# EAGLE board zenith (EAGLE 9.6.2), part 1 of 2
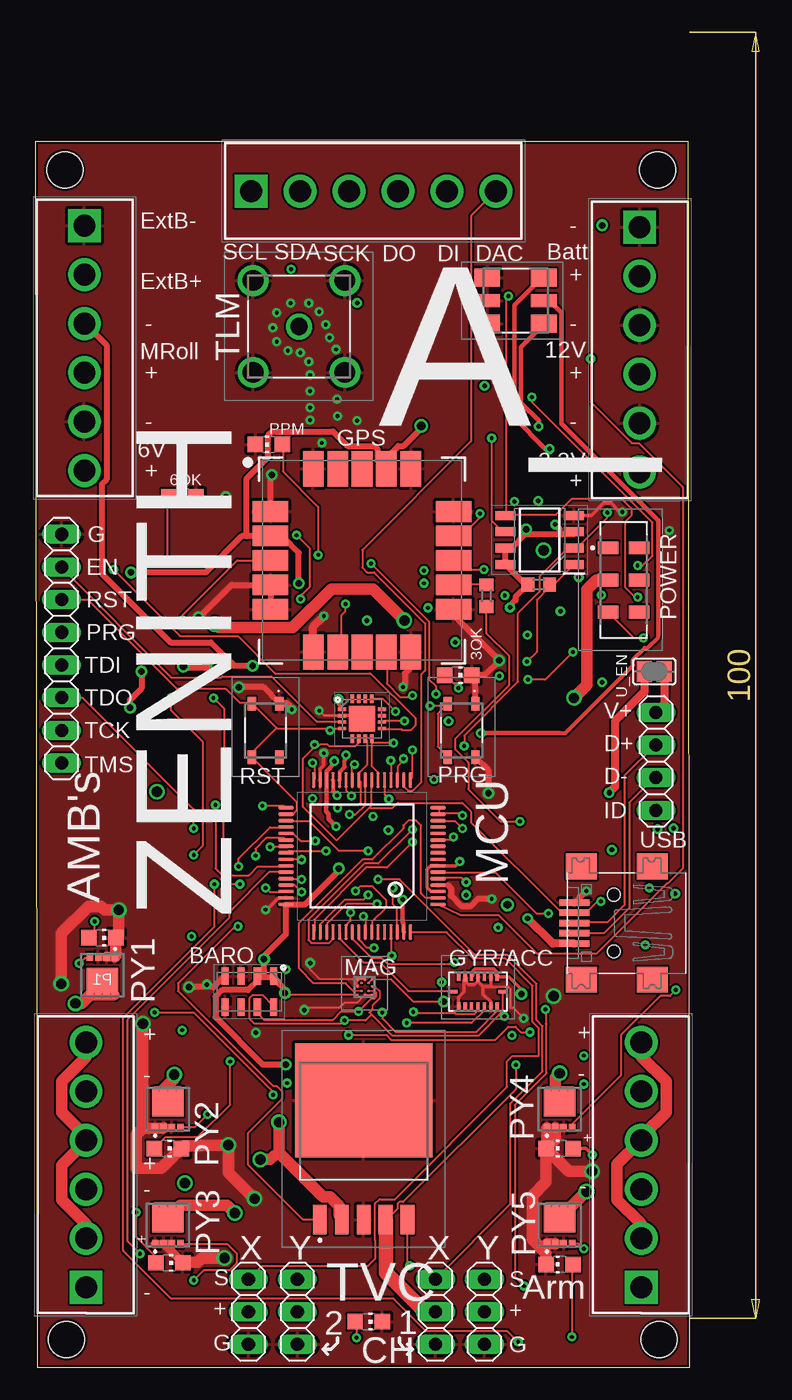
[diagram p5: board, top side]
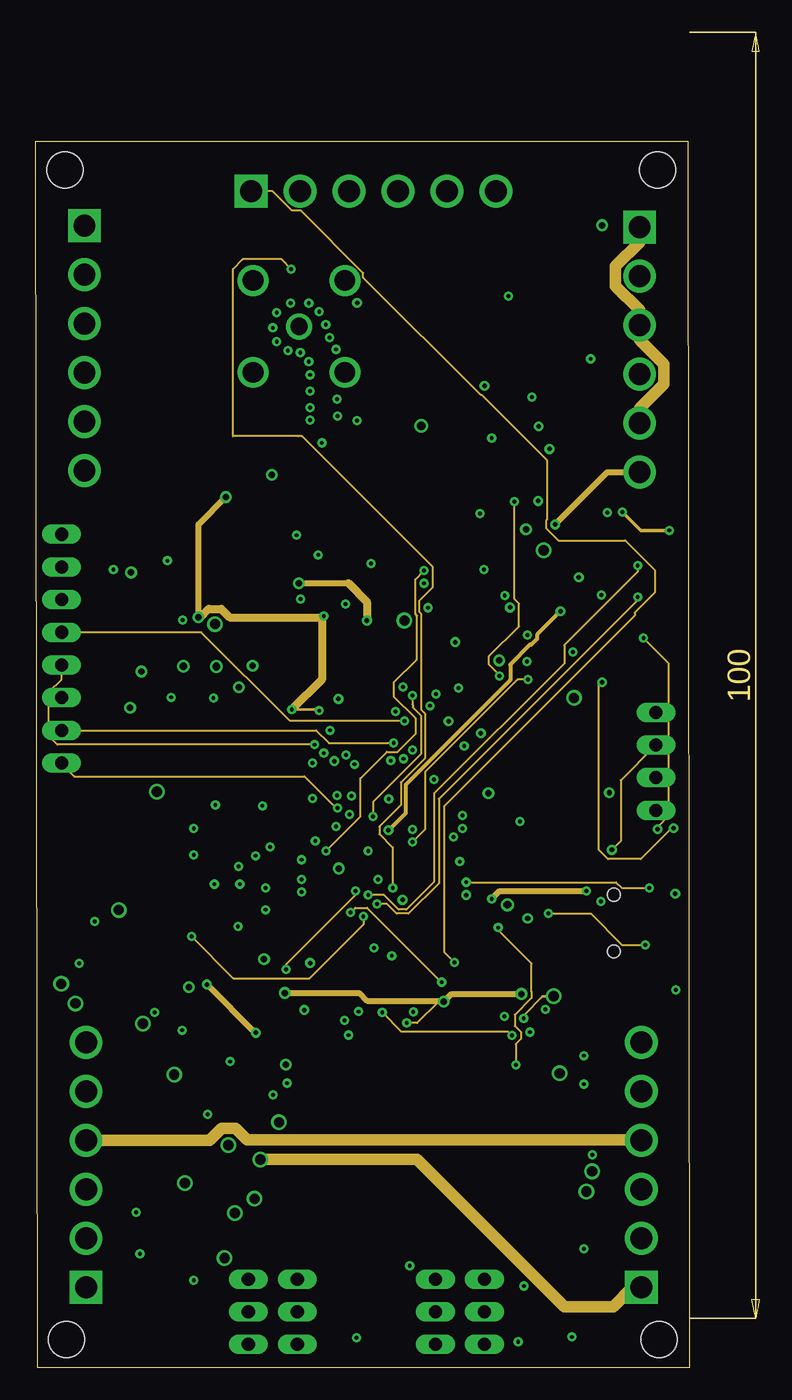
[diagram p6: board, inner layer Route2]
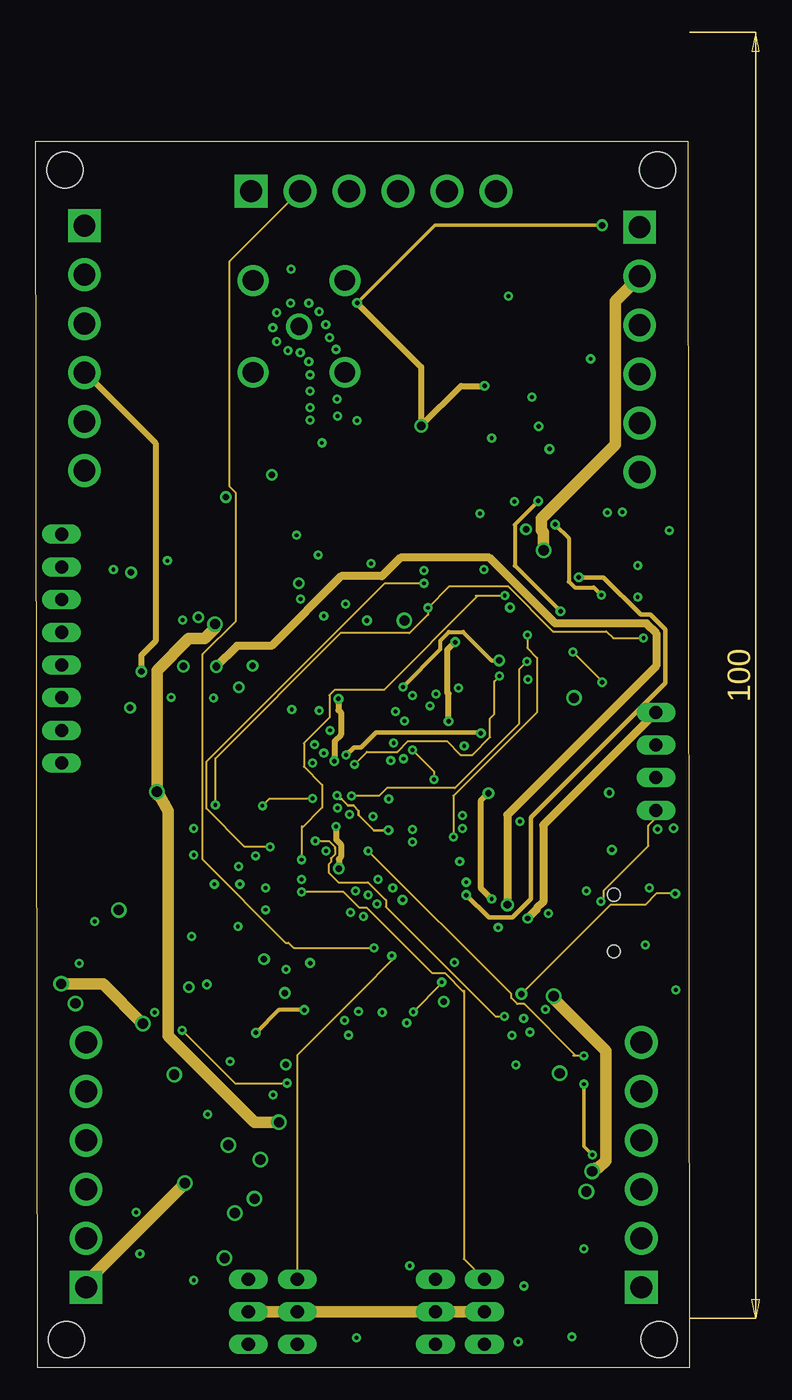
[diagram p7: board, inner layer Route15]
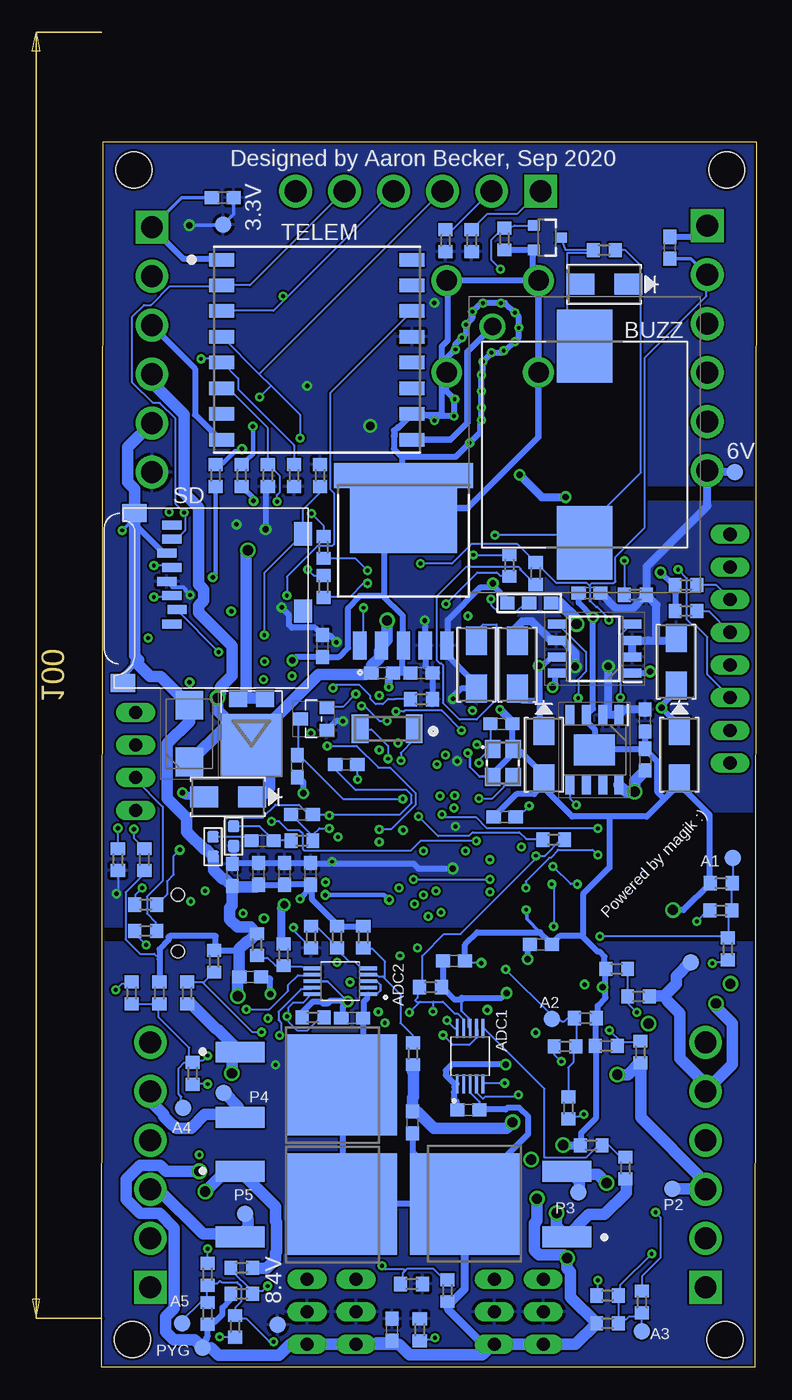
[diagram p8: board, bottom side, seen from below]

Size 50.91 x 95.3 mm. Coordinates in mm from the lower left corner, seen from the top.
Outline: 0.13,0 50.91,0 50.78,95.3 0,95.3 0.13,0
Copper layers (1+2*15+16): Top 0.035mm / dielectric 0.2mm / Route2 0.0175mm / dielectric 1.065mm / Route15 0.0175mm / dielectric 0.2mm / Bottom 0.035mm
Design rules "default *": minimum track width 5mil, minimum drill 0.3mm, track to track 6mil, track to pad 6mil, pad to pad 5mil, via to via 10mil, smd to smd 5mil, copper to edge 0.2mm, drill to drill 10mil, minimum pad ring 10mil, minimum via ring 8mil, stop-mask expansion 4mil, vias tented up to drill 0mil, thermal gap 10mil
Net classes: 0 default: width 0.127 mm
Holes 2.8 mm at 2.41,2.16 48.51,2.16 2.29,93.09 48.39,93.09

## Footprints (pad centres in the part's own frame; a part is rotated, then mirrored left to right if it is on the bottom)
B1,27 = smd 1.27 x 1.27: TP 0,0
CHIP-LED0805 = smd 1.2 x 1.2: A 0,-1.05; C 0,1.05
MICROSD = smd 0.7 x 1.5: 1 9,-10.64; 2 7.9,-10.24; 3 6.8,-10.64; 4 5.7,-11.04; 5 4.6,-10.64; 6 3.5,-11.04; 7 2.4,-10.64; 8 1.3,-10.64 | smd 1.8 x 1.4: CD1 2,-0.44; CD2 8,-0.44 | smd 1.4 x 1.9: MT1 0.4,-13.54; MT2 13.6,-14.44
SOT-23 = smd 1.016 x 1.143: 1 -0.889,-1.016; 2 0.889,-1.016; 3 0,1.016
L0603 = smd 0.889 x 0.889: 1 -0.762,0; 2 0.762,0
C0603 = smd 1.1 x 1: 1 -0.85,0; 2 0.85,0
USB-MINIB = smd 0.5 x 2.308: D+ 0,4.064; D- -0.8,4.064; GND 1.6,4.064; ID 0.8,4.064; VBUS -1.6,4.064 | smd 2 x 2.4: GND1 -4.4,-2; GND2 -4.4,3.5; GND3 4.4,3.5; GND4 4.4,-2 | hole 1: -2.2,1; 2.2,1
SMA_DIO = smd 2.18 x 1.63: 1 -1.857,0; 2 1.857,0
SMA_NO_LABELS = smd 2.18 x 1.63: 1 -1.857,0; 2 1.857,0
TO-277A(SMPC) = smd 1.4 x 1.3: A1 -1.04,-2.725; A2 1.04,-2.725 | smd 4.72 x 4.8: K 0,0.875
EPSON-FA-238 = smd 1.4 x 1.2: 1 -1.1,-0.8; 2 1.1,-0.8; 3 1.1,0.8; 4 -1.1,0.8
SOIC127P600X100-9N = smd 1.525 x 0.7: 1 -2.712,1.905; 2 -2.712,0.635; 3 -2.712,-0.635; 4 -2.712,-1.905; 5 2.712,-1.905; 6 2.712,-0.635; 7 2.712,0.635; 8 2.712,1.905 | smd 2.4 x 3.2: 9 0,0
BMI088 = smd 0.25 x 0.675: 1 -1.5,1.165; 2 -1,1.165; 3 -0.5,1.165; 4 0,1.165; 5 0.5,1.165; 6 1,1.165; 7 1.5,1.165; 9 1.5,-1.165; 10 1,-1.165; 11 0.5,-1.165; 12 0,-1.165; 13 -0.5,-1.165; 14 -1,-1.165; 15 -1.5,-1.165 | smd 0.675 x 0.25: 8 1.915,0; 16 -1.915,0
BMM150 = smd 0.2 x 0.2: A1 0.566,0.601; A3 0.566,0.035; A5 0.566,-0.601; B2 0.283,0.318; B4 0.283,-0.283; C1 0,0.601; C5 0,-0.601; D2 -0.283,0.318; D4 -0.283,-0.283; E1 -0.566,0.601; E3 -0.566,0.035; E5 -0.566,-0.601
SOIC127P620X171-8N = smd 1.35 x 0.7: 1 -2.95,1.905; 2 -2.95,0.635; 3 -2.95,-0.635; 4 -2.95,-1.905; 5 2.95,-1.905; 6 2.95,-0.635; 7 2.95,0.635; 8 2.95,1.905
QFN50P300X300X65-17N = smd 0.65 x 0.25: 1 -1.55,0.75; 2 -1.55,0.25; 3 -1.55,-0.25; 4 -1.55,-0.75; 9 1.55,-0.75; 10 1.55,-0.25; 11 1.55,0.25; 12 1.55,0.75 | smd 0.25 x 0.65: 5 -0.75,-1.55; 6 -0.25,-1.55; 7 0.25,-1.55; 8 0.75,-1.55; 13 0.75,1.55; 14 0.25,1.55; 15 -0.25,1.55; 16 -0.75,1.55 | smd 2 x 2: 17 0,0
KTT0005B = smd 2.16 x 1.02: 1 12.461,-3.4; 2 12.461,-1.7; 3 12.461,0; 4 12.461,1.7; 5 12.461,3.4 | smd 6.99 x 8.33: 6 1.786,0 | smd 1.91 x 1.235: 7 -0.754,4.782; 8 -0.754,-4.782
SON125P300X500X100-8N = smd 1.35 x 0.55: 1 -1.2,1.875; 2 -1.2,0.625; 3 -1.2,-0.625; 4 -1.2,-1.875; 5 1.2,-1.875; 6 1.2,-0.625; 7 1.2,0.625; 8 1.2,1.875
SOIC127P600X175-8N = smd 1.55 x 0.7: 1 -2.675,1.905; 2 -2.675,0.635; 3 -2.675,-0.635; 4 -2.675,-1.905; 5 2.675,-1.905; 6 2.675,-0.635; 7 2.675,0.635; 8 2.675,1.905
SHDR6W105P0X381_1X6_2285X730X8 = drill 1.7 pad 2.55 square: 1 0,0 | drill 1.7 pad 2.55: 2 3.81,0; 3 7.62,0; 4 11.43,0; 5 15.24,0; 6 19.05,0
1420701211 = drill 1.346 pad 2.019: 1 0,0 | drill 1.6 pad 2.4: 2 -3.569,3.569; 3 -3.569,-3.569; 4 3.569,-3.569; 5 3.569,3.569
1X08 = drill 1.016 long: 1 -8.89,0; 2 -6.35,0; 3 -3.81,0; 4 -1.27,0; 5 1.27,0; 6 3.81,0; 7 6.35,0; 8 8.89,0
1X04 = drill 1.016 long: 1 -3.81,0; 2 -1.27,0; 3 1.27,0; 4 3.81,0
1X03 = drill 1.016 long: 1 -2.54,0; 2 0,0; 3 2.54,0
LQFP64-05 = smd 1.2 x 0.25: 1 -5.915,3.759; 2 -5.915,3.251; 3 -5.915,2.743; 4 -5.915,2.261; 5 -5.915,1.753; 6 -5.915,1.245; 7 -5.915,0.762; 8 -5.915,0.254; 9 -5.915,-0.254; 10 -5.915,-0.762; 11 -5.915,-1.245; 12 -5.915,-1.753; 13 -5.915,-2.261; 14 -5.915,-2.743; 15 -5.915,-3.251; 16 -5.915,-3.759; 33 5.915,-3.759; 34 5.915,-3.251; 35 5.915,-2.743; 36 5.915,-2.261; 37 5.915,-1.753; 38 5.915,-1.245; 39 5.915,-0.762; 40 5.915,-0.254; 41 5.915,0.254; 42 5.915,0.762; 43 5.915,1.245; 44 5.915,1.753; 45 5.915,2.261; 46 5.915,2.743; 47 5.915,3.251; 48 5.915,3.759 | smd 0.25 x 1.2: 17 -3.759,-5.915; 18 -3.251,-5.915; 19 -2.743,-5.915; 20 -2.261,-5.915; 21 -1.753,-5.915; 22 -1.245,-5.915; 23 -0.762,-5.915; 24 -0.254,-5.915; 25 0.254,-5.915; 26 0.762,-5.915; 27 1.245,-5.915; 28 1.753,-5.915; 29 2.261,-5.915; 30 2.743,-5.915; 31 3.251,-5.915; 32 3.759,-5.915; 49 3.759,5.915; 50 3.251,5.915; 51 2.743,5.915; 52 2.261,5.915; 53 1.753,5.915; 54 1.245,5.915; 55 0.762,5.915; 56 0.254,5.915; 57 -0.254,5.915; 58 -0.762,5.915; 59 -1.245,5.915; 60 -1.753,5.915; 61 -2.261,5.915; 62 -2.743,5.915; 63 -3.251,5.915; 64 -3.759,5.915
QBLP679ERGB = smd 2 x 1.4: 1 2.2,-1.8; 3 2.2,1.8; 4 -2.2,1.8; 6 -2.2,-1.8 | smd 2 x 1: 2 2.2,0; 5 -2.2,0
CMT1603SMTTR = smd 5.7 x 4.3: 1 -7.65,0; 2 7.65,0
LT1764AEQ33TRPBF = smd 1.067 x 2.286: 1 -3.404,-6.292; 2 -1.702,-6.292; 3 0,-6.292; 4 1.702,-6.292; 5 3.404,-6.292 | smd 10.668 x 8.89: 6 0,2.979
CSD16327 = smd 0.5 x 0.63: 1 -0.975,-1.435; 2 -0.325,-1.435; 3 0.325,-1.435; 4 0.975,-1.435 | smd 0.5 x 0.41: 5 0.975,1.545; 6 0.325,1.545; 7 -0.325,1.545; 8 -0.975,1.545 | smd 2.45 x 1.9: 9 0,0.39
SOT23-3 = smd 0.8 x 0.9: 1 -0.95,-1; 2 0.95,-1; 3 0,1.1
R0603 = smd 1 x 1.1: 1 -0.85,0; 2 0.85,0
PWR163_DPAK = smd 1.62 x 3.81: 1 -2.54,-10.795; 2 2.54,-10.795 | smd 7.87 x 8.51: 3 0,-2.855
PTS810SJG250SMTRLFS = smd 1.05 x 0.65: 1 -2.075,1.075; 2 2.075,1.075; 3 -2.075,-1.075; 4 2.075,-1.075
JS202011JCQN = smd 1 x 1.6: 1 -2.5,-0.95; 2 0,-0.95; 3 2.5,-0.95; 5 2.5,1.45; 6 0,1.45; 7 -2.5,1.45
SOLDERJUMPER_2WAY_OPEN_0603 = smd 1.1 x 1: 1 -1.7,0; 2 0,0; 3 1.7,0
XCVR_RFM95W-868S2 = smd 1.95 x 1.05: 1 -7.4,7; 2 -7.4,5; 3 -7.4,3; 4 -7.4,1; 5 -7.4,-1; 6 -7.4,-3; 7 -7.4,-5; 8 -7.4,-7; 9 7.4,-7; 10 7.4,-5; 11 7.4,-3; 12 7.4,-1; 13 7.4,1; 14 7.4,3; 15 7.4,5; 16 7.4,7
SOP50P490X110-10N = smd 1.47 x 0.28: 1 -2.15,1; 2 -2.15,0.5; 3 -2.15,0; 4 -2.15,-0.5; 5 -2.15,-1; 6 2.15,-1; 7 2.15,-0.5; 8 2.15,0; 9 2.15,0.5; 10 2.15,1
SAM-M8Q = smd 2.75 x 1.6: 1 -7.125,3.8; 2 -7.125,1.9; 3 -7.125,0; 4 -7.125,-1.9; 5 -7.125,-3.8; 11 7.125,-3.8; 12 7.125,-1.9; 13 7.125,0; 14 7.125,1.9; 15 7.125,3.8 | smd 1.6 x 2.75: 6 -3.8,-7.125; 7 -1.9,-7.125; 8 0,-7.125; 9 1.9,-7.125; 10 3.8,-7.125; 16 3.8,7.125; 17 1.9,7.125; 18 0,7.125; 19 -1.9,7.125; 20 -3.8,7.125
SJ = smd 1.168 x 1.6: 1 -0.762,0; 2 0.762,0
ABS-10 = smd 1.3 x 2.2: 1 -2.1,0; 2 2.1,0
DIOM5436X247N = smd 2.25 x 2.15: 1 -2.2,0; 2 2.2,0

## Placement (x,y rotation side)
3.3V  TPB1,27  [B1,27]  41.45,88.85 90 bottom
3.3VOK  RED  [CHIP-LED0805]  32.89,53.82 270 top
6OK  RED  [CHIP-LED0805]  11.43,67.69 270 top
6V  TPB1,27  [B1,27]  1.65,69.6 0 bottom
8.4V  TPB1,27  [B1,27]  37.21,3.3 0 bottom
8.4VOK  RED  [CHIP-LED0805]  25.91,3.56 270 top
0473340001  MICROSD  [MICROSD]  34.8,66.8 270 bottom
ACC3  TPB1,27  [B1,27]  1.8,39.6 0 bottom
ACC4  TPB1,27  [B1,27]  15.88,27.08 0 bottom
ACC5  TPB1,27  [B1,27]  8.89,2.79 0 bottom
ACC6  TPB1,27  [B1,27]  44.58,20.19 0 bottom
ACC7  TPB1,27  [B1,27]  44.63,3.43 0 bottom
BAT54C,215  [SOT-23]  34.42,50.42 90 bottom
BLM18AG601SN1D  [L0603]  40.64,41.3 270 bottom
C1  100nF  [C0603]  16.74,32.89 0 bottom
C2  10uF  [C0603]  41.48,90.93 0 bottom
C3  0.1uF  [C0603]  35.69,46.74 90 bottom
C4  2.2uF  [C0603]  34.65,38.38 270 bottom
C5  0.1uF  [C0603]  36.68,38.38 270 bottom
C6  2.2uF  [C0603]  38.38,40.94 180 bottom
C7  1uF  [C0603]  6.71,87.05 90 bottom
C8  1uF  [C0603]  33.73,56.08 270 bottom
C9  100nF  [C0603]  31.42,27.15 0 bottom
C10  0.1uF  [C0603]  39.34,30.35 180 bottom
C11  100nF  [C0603]  23.49,31.6 180 bottom
C12  10uF  [C0603]  8.64,47.24 270 bottom
C15  10uF  [C0603]  8.64,50.29 90 bottom
C18  0.1uF  [C0603]  35.33,42.98 0 bottom
C19  0.1uF  [C0603]  22.38,20.02 0 bottom
C20  0.1uF  [C0603]  38.71,38.38 270 bottom
C21  10uF  [C0603]  29.08,53.98 180 bottom
C22  10uF  [C0603]  26.04,53.98 0 bottom
C23  0.1uF  [C0603]  40.74,38.28 270 bottom
C24  0.1uF  [C0603]  31.88,46.86 180 bottom
C25  10uF  [C0603]  28.32,2.92 90 bottom
C26  10uF  [C0603]  26.72,19.05 270 bottom
C29  10uF  [C0603]  12.95,60.2 180 bottom
C30  7pF  [C0603]  19.81,50.04 180 bottom
C31  7pF  [C0603]  19.56,42.8 180 bottom
CE1  TPB1,27  [B1,27]  43.05,1.52 180 bottom
CE2  TPB1,27  [B1,27]  5.08,31.5 0 bottom
CE3  TPB1,27  [B1,27]  6.5,13.87 0 bottom
CE4  TPB1,27  [B1,27]  13.84,13.59 0 bottom
CE5  TPB1,27  [B1,27]  41.4,21.34 0 bottom
CE6  TPB1,27  [B1,27]  39.75,11.94 0 bottom
CN1  [USB-MINIB]  45.97,34.54 90 top
CR1  B120-13-F  [SMA_DIO]  41.07,44.35 180 bottom
CR2  B120-13-F  [SMA_DIO]  11.81,84.2 180 bottom
CR3  B120-13-FNO_LABELS  [SMA_NO_LABELS]  18.57,54.64 270 bottom
CR4  B120-13-FNO_LABELS  [SMA_NO_LABELS]  21.74,54.64 270 bottom
CR5  B120-13-F  [SMA_DIO]  16.51,47.62 270 bottom
CR6  B120-13-F  [SMA_DIO]  5.97,47.62 270 bottom
CR7  B120-13-FNO_LABELS  [SMA_NO_LABELS]  6.22,54.86 270 bottom
D2  SS5P6-M3/86A  [TO-277A(SMPC)]  39.24,49.28 180 bottom
FA-23816.0000MA30X-AG0  FA-238_16.0000MB-K3  [EPSON-FA-238]  19.68,46.99 270 bottom
IC1  BD60GC0WEFJ-E2  [SOIC127P600X100-9N]  12.57,48.01 270 bottom
IC2  BMI088  [BMI088]  34.42,29.21 0 top
IC3  BMM150  [BMM150]  25.63,29.57 0 top
IC4  BD6211F-E2  [SOIC127P620X171-8N]  12.57,55.88 180 bottom
IC5  MKL02Z32VFG4  [QFN50P300X300X65-17N]  25.4,50.42 0 top
IC6  TPS7A4533KTTR  [KTT0005B]  27.43,68.58 270 bottom
IC7  MS561101BA03-00  [SON125P300X500X100-8N]  16.64,29.21 270 top
IC9  LE25U40CMC-AH  [SOIC127P600X175-8N]  39.22,64.34 180 top
J1  1727052  [SHDR6W105P0X381_1X6_2285X730X8]  3.81,88.77 270 top
J2  1727052  [SHDR6W105P0X381_1X6_2285X730X8]  47.12,6.22 90 top
J3  1727052  [SHDR6W105P0X381_1X6_2285X730X8]  46.99,88.65 270 top
J4  1727052  [SHDR6W105P0X381_1X6_2285X730X8]  16.76,91.44 0 top
J9  1727052  [SHDR6W105P0X381_1X6_2285X730X8]  3.94,6.22 90 top
J10  142-0701-211  [1420701211]  20.5,80.92 0 top
JP2  [1X08]  2.03,55.88 270 top
JP3  [1X04]  48.26,47.12 90 top
JP4  [1X03]  31.11,4.32 270 top
JP5  [1X03]  34.93,4.32 270 top
JP6  [1X03]  16.56,4.32 270 top
JP7  [1X03]  20.37,4.32 270 top
K3  MK20DX256VLH7  [LQFP64-05]  25.4,39.75 180 top
LED1  QBLP679E-RGB  [QBLP679ERGB]  37.34,82.93 180 top
LED2  RED  [CHIP-LED0805]  5.21,33.4 270 top
LED3  RED  [CHIP-LED0805]  10.29,17.02 270 top
LED4  RED  [CHIP-LED0805]  10.41,8.13 270 top
LED6  [CHIP-LED0805]  18.16,71.75 90 top
LED7  RED  [CHIP-LED0805]  40.77,17.02 90 top
LED8  RED  [CHIP-LED0805]  40.77,8 90 top
LS1  CMT-1603-SMT-TR  [CMT1603SMTTR]  13.34,71.75 90 bottom
LT1764#TRPBF  LT1764AEQ-3.3#TRPBF  [LT1764AEQ33TRPBF]  25.53,17.78 0 top
Q1  CSD17575Q3  [CSD16327]  5.21,30.48 180 top
Q2  CSD17575Q3  [CSD16327]  10.29,20.07 0 top
Q5  CSD17575Q3  [CSD16327]  10.29,11.05 0 top
Q6  CSD17575Q3  [CSD16327]  40.77,20.07 0 top
Q7  CSD17575Q3  [CSD16327]  40.77,11.05 0 top
Q8  220mA/50V/3.5Ω  [SOT23-3]  16.28,87.83 270 bottom
R1  2.2k  [R0603]  34.47,27.2 180 bottom
R2  2.2k  [R0603]  25.32,29.57 0 bottom
R3  68  [R0603]  40.01,69.34 270 bottom
R4  [L0603]  42.24,40.49 90 bottom
R5  100k  [R0603]  5.46,60.83 0 bottom
R6  5.6  [R0603]  42.04,69.34 270 bottom
R7  1k  [R0603]  11.81,86.87 180 bottom
R8  33  [R0603]  47.47,35.97 0 bottom
R9  100k  [R0603]  49.63,39.47 90 bottom
R10  620  [R0603]  32.59,33.45 90 bottom
R11  1000  [R0603]  34.62,33.45 270 bottom
R12  100k  [R0603]  39.14,60.86 0 top
R14  100k  [R0603]  5.46,58.8 0 bottom
R15  3.3k  [R0603]  17.14,61.72 270 bottom
R16  33  [R0603]  47.47,33.93 180 bottom
R17  470  [R0603]  33.66,60.71 90 bottom
R18  470  [R0603]  33.66,63.75 90 bottom
R21  470  [R0603]  35.33,40.94 180 bottom
R22  100k  [R0603]  19.58,87.73 270 bottom
R23  220  [R0603]  2.21,32.54 270 bottom
R24  10k  [R0603]  33.91,69.34 90 bottom
R25  1k  [R0603]  26.7,24.38 270 bottom
R26  330  [R0603]  30.56,33.45 90 bottom
R27  100k  [R0603]  2.72,37.64 180 bottom
R28  PWR163S-25-2R20J  [PWR163_DPAK]  29.34,21.97 270 bottom
R29  100  [R0603]  2.74,35.53 0 bottom
R30  1k  [R0603]  9.14,28.83 180 bottom
R31  330  [R0603]  10.85,30.99 180 bottom
R32  220  [R0603]  14.61,20.17 270 bottom
R33  100  [R0603]  14.86,24.97 0 bottom
R34  100k  [R0603]  13.28,27.15 0 bottom
R35  1k  [R0603]  9.02,24.51 90 bottom
R36  330  [R0603]  11.66,24.99 180 bottom
R37  220  [R0603]  11.56,5.59 180 bottom
R38  100  [R0603]  8.89,5.08 270 bottom
R39  100k  [R0603]  11.56,3.43 180 bottom
R40  1k  [R0603]  10.16,15.49 90 bottom
R41  330  [R0603]  12.83,17.27 180 bottom
R42  220  [R0603]  48.56,29.11 90 bottom
R43  100  [R0603]  43.82,22.86 90 bottom
R44  100k  [R0603]  46.41,29.11 90 bottom
R45  1k  [R0603]  44.25,29.11 90 bottom
R46  330  [R0603]  42.16,31.57 90 bottom
R47  220  [R0603]  42.67,7.24 90 bottom
R48  100  [R0603]  40.51,3.17 90 bottom
R49  100k  [R0603]  42.67,4.19 270 bottom
R50  1k  [R0603]  40.01,7.75 180 bottom
R51  330  [R0603]  40.01,5.71 180 bottom
R52  1k  [R0603]  19.18,62.36 270 bottom
R53  22  [R0603]  35.08,59.99 90 top
R54  22  [R0603]  15.75,41.02 180 bottom
R55  PWR163S-25-2R20J  [PWR163_DPAK]  25.53,12.7 90 bottom
R57  100k  [R0603]  35.94,69.34 270 bottom
R58  100k  [R0603]  37.97,69.34 270 bottom
R59  220  [R0603]  9.4,60.07 180 bottom
R60  68  [R0603]  26.04,51.94 0 bottom
R61  3.3k  [R0603]  26.8,6.48 0 bottom
R62  560  [R0603]  24,5.97 90 bottom
R63  2.2k  [R0603]  24.16,87.6 270 bottom
R64  2.2k  [R0603]  22.12,87.6 270 bottom
R65  330  [R0603]  26.16,2.92 90 bottom
R66  100k  [R0603]  47.57,39.47 90 bottom
R67  680  [R0603]  38.81,32.87 90 bottom
R68  560  [R0603]  36.75,32.08 90 bottom
R69  PWR163S-25-2R20J  [PWR163_DPAK]  29.34,12.7 270 bottom
S2  PTS810SJG250SMTRLFS  [PTS810SJG250SMTRLFS]  17.91,49.53 270 top
S3  PTS810SJG250SMTRLFS  [PTS810SJG250SMTRLFS]  33.15,49.53 270 top
S4  JS202011JCQN  [JS202011JCQN]  45.49,61.21 270 top
SJ1  [SOLDERJUMPER_2WAY_OPEN_0603]  17.65,59.44 0 bottom
U1  RFM95W-868S2  [XCVR_RFM95W-868S2]  34.16,79.12 0 bottom
U2  ADS1015IDGST  [SOP50P490X110-10N]  22.25,24.21 90 bottom
U4  U-BLOX_SAM_M8Q-0-10  [SAM-M8Q]  25.4,62.74 0 top
U6  ADS1015IDGST  [SOP50P490X110-10N]  32.33,30.02 180 bottom
USBPOW  [SJ]  48.13,54.1 180 top
Y2  ABS10-32.768KHZ-9-T  [ABS-10]  28.7,49.66 180 bottom
Z2  1SMB5929BT3G  [DIOM5436X247N]  44.07,49.28 90 bottom